# Altium project Half-Bridge Converter.PrjPcb
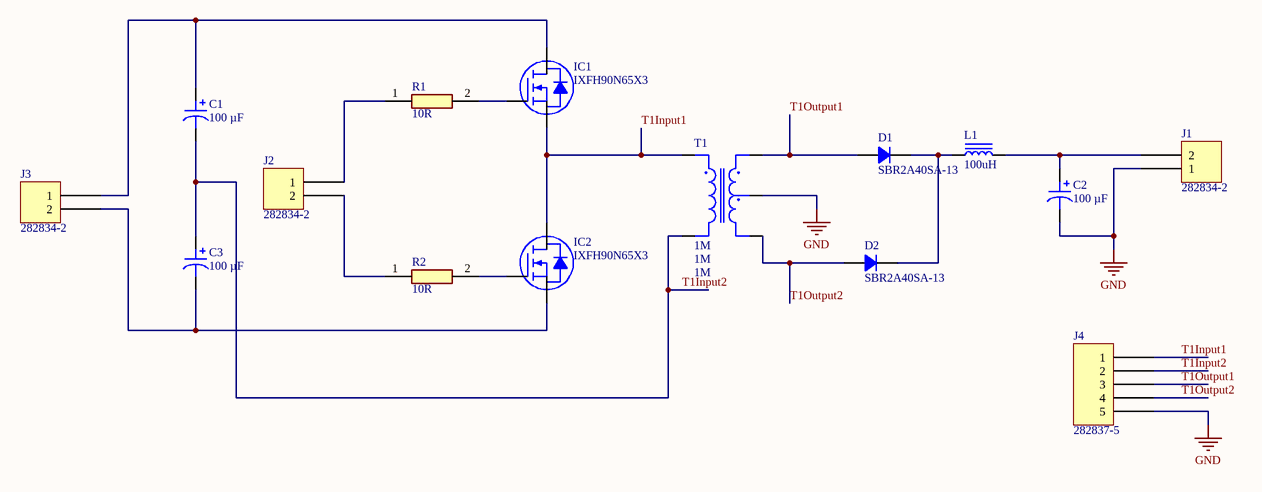
[diagram p0: Sheet1.SchDoc]
1 sheet, 15 parts. Net scope: global (net labels, ports and power ports of the same name join across sheets).
Board file: PCB2.PcbDoc

## Sheet Sheet1.SchDoc
size A4; SheetNumber: 1; SheetTotal: 1

### Parts
C1  100 µF  [CAP AL TH D8 L3.5 H12.5]
C2  100 µF  [CAP AL TH D8 L3.5 H12.5]
C3  100 µF  [CAP AL TH D8 L3.5 H12.5]
D1  SBR2A40SA-13  [DO214AC SMA]
D2  SBR2A40SA-13  [DO214AC SMA]
IC1  IXFH90N65X3  [IXYS TO-247 IXFH FLAT]
IC2  IXFH90N65X3  [IXYS TO-247 IXFH FLAT]
J1  282834-2  [TE 282834-2]
J2  282834-2  [TE 282834-2]
J3  282834-2  [TE 282834-2]
J4  282837-5  [TE 282837-5]
L1  100uH  [BOURNS SRR1280]
R1  10R  [RESAD1680W59L680D250]
R2  10R  [RESAD1680W59L680D250]
T1  L1: 1M  (hidden comment: Ideal Transformer With Central Tap)

### Nets
GND: C2.2 J1.1 J4.5 T1.4
T1Input1: IC1.S IC2.D J4.1 T1.1
T1Input2: C1.2 C3.1 J4.2 T1.2
T1Output1: D1.1 J4.3 T1.3
T1Output2: D2.1 J4.4 T1.5
NetC1_1: C1.1 IC1.D J3.1
NetC2_1: C2.1 J1.2 L1.2
NetC3_2: C3.2 IC2.S J3.2
NetD1_2: D1.2 D2.2 L1.1
NetIC1_G: IC1.G R1.2
NetIC2_G: IC2.G R2.2
NetJ2_1: J2.1 R1.1
NetJ2_2: J2.2 R2.1

### Library data of the parts
C1-C3 = UKL1E101MPD1TD: CAP ALUM 100UF 20% 25V RADIAL; manufacturer: Nichicon; Lifetime @ Temp.: 2000 Hrs @ 85°C; Polarization: Polar; Ripple Current @ High Frequency: 420 mA @ 10 kHz; Ripple Current @ Low Frequency: 280 mA @ 120 Hz; Part Number: UKL1E101MPD1TD; Applications: General Purpose; Capacitance: 100 µF; componentlink1description: Datasheet; componentlink1url: http://nichicon-us.com/english/products/pdfs/e-ukl.pdf; componentlink2description: DigiKey Link; componentlink2url: https://www.digikey.com/en/products/detail/nichicon/UKL1E101MPD1TD/4317977; Device Package: Radial, Can; Height - Seated (Max): 0.492" (12.50mm); lastupdated: 3.06.2024 20:06:12; Lead Spacing: 0.138" (3.50mm); Lifecycle Status: Active; Minimum Order: 1; Mounting Type: Through Hole; Operating Temperature: -40°C ~ 85°C; Package / Case: Radial, Can; packaging: TapeAndBox; partid: 7210; Part Status: Active; price: 0.18; series: UKL; Size / Dimension: 0.315" Dia (8.00mm); Supplier 1: DigiKey; Supplier Part Number 1: 493-10488-1-ND; Tolerance: ±20%; value: 100 µF; Voltage - Rated: 25 V
D1 D2 = SBR2A40SA-13: DIODE SBR 40V 2A SMA; Manufacturer: Diodes Incorporated; Current - Reverse Leakage @ Vr: 500 µA @ 40 V; Diode Type: Super Barrier; Speed: Standard Recovery >500ns, > 200mA (Io); Voltage - Forward (Vf) (Max) @ If: 550 mV @ 2 A; Part Number: SBR2A40SA-13; ComponentLink1Description: Datasheet; ComponentLink1URL: https://www.diodes.com/assets/Datasheets/SBR2A40SA.pdf; ComponentLink2Description: DigiKey Link; ComponentLink2URL: https://www.digikey.com/en/products/detail/diodes-incorporated/SBR2A40SA-13/7725177; Current - Average Rectified (Io): 2A; LastUpdated: 3.06.2024 19:54:28; Lifecycle Status: Active; Minimum Order: 1; Mounting Type: Surface Mount; Operating Temperature - Junction: -65°C ~ 150°C; Package / Case: DO-214AC, SMA; Packaging: TapeAndReel; PartId: 3438; Part Status: Active; Price: 0.13; Series: SBR®; Supplier 1: DigiKey; Supplier Part Number 1: SBR2A40SA-13DICT-ND; Supplier Device Package: SMA; Voltage - DC Reverse (Vr) (Max): 40 V
IC1 IC2 = IXFH90N65X3: MOSFET 90A 650V X3 TO247; Manufacturer: IXYS; Current - Continuous Drain (Id) @ 25°C: 90A (Tc); Drive Voltage (Max Rds On,  Min Rds On): 10V; FET Type: N-Channel; Gate Charge (Qg) (Max) @ Vgs: 95 nC @ 10 V; Input Capacitance (Ciss) (Max) @ Vds: 6080 pF @ 25 V; Power Dissipation (Max): 960W (Tc); Rds On (Max) @ Id, Vgs: 33mOhm @ 45A, 10V; Vgs (Max): ±20V; Vgs(th) (Max) @ Id: 5.2V @ 4mA; Part Number: IXFH90N65X3; ComponentLink2Description: DigiKey Link; ComponentLink2URL: https://www.digikey.com/en/products/detail/ixys/IXFH90N65X3/15776033; Drain to Source Voltage (Vdss): 650 V; LastUpdated: 10.08.2022 04:39:14; Lifecycle Status: Active; Minimum Order: 1; Mounting Type: Through Hole; Operating Temperature: -55°C ~ 150°C (TJ); Packaging: Tube; Part Status: Active; Price: 11.41; Series: HiPerFET™, Ultra X3; Supplier 1: DigiKey; Supplier Part Number 1: 238-IXFH90N65X3-ND; Supplier Device Package: TO-247 (IXFH); Technology: MOSFET (Metal Oxide)
J1-J3 = 282834-2: TERM BLK 2P SIDE ENT 2.54MM PCB; Manufacturer: TE Connectivity AMP Connectors; Current: 10A; Mating Orientation: Horizontal with Board; Number of Levels: 1; Pitch: 0.100" (2.54mm); Positions Per Level: 2; Voltage: 150V; Wire Gauge: 16-30 AWG; Wire Termination: Screw - Rising Cage Clamp; Part Number: 282834-2; Color: Green; ComponentLink1Description: Datasheet; ComponentLink1URL: https://www.te.com/commerce/DocumentDelivery/DDEController?Action=srchrtrv&DocNm=282834&DocType=Customer+Drawing&DocLang=English; ComponentLink2Description: DigiKey Link; ComponentLink2URL: http://digikey.com/product-detail/en/te-connectivity-amp-connectors/282834-2/A98333-ND/1150135; LastUpdated: 15.01.2020 04:15:38; Lifecycle Status: Active; Minimum Order: 1; Mounting Type: Through Hole; Packaging: Bulk; Part Status: Active; Price: 0.88; Series: Buchanan; Supplier 1: DigiKey; Supplier Part Number 1: A98333-ND
J4 = 282837-5: TERM BLK 5P SIDE ENT 5.08MM PCB; Manufacturer: TE Connectivity AMP Connectors; Current: 13.5A; Mating Orientation: Horizontal with Board; Number of Levels: 1; Pitch: 0.200" (5.08mm); Positions Per Level: 5; Voltage: 300V; Wire Gauge: 16-28 AWG; Wire Termination: Screw - Rising Cage Clamp; Part Number: 282837-5; Color: Green; ComponentLink1Description: Datasheet; ComponentLink1URL: https://www.te.com/commerce/DocumentDelivery/DDEController?Action=srchrtrv&DocNm=282837&DocType=Customer+Drawing&DocLang=English; ComponentLink2Description: DigiKey Link; ComponentLink2URL: http://digikey.com/product-detail/en/te-connectivity-amp-connectors/282837-5/282837-5-ND/2259492; Features: Interlocking (Side); LastUpdated: 21.06.2022 15:01:10; Lifecycle Status: Active; Minimum Order: 1; Mounting Type: Through Hole; Packaging: Tray; Part Status: Active; Price: 1.77; Series: Buchanan; Supplier 1: DigiKey; Supplier Part Number 1: 282837-5-ND
L1 = SRR1280-271K: FIXED IND 270UH 1.2A 450MOHM SMD; Manufacturer: Bourns Inc.; Current - Saturation: 1.6A; DC Resistance (DCR): 450mOhm Max; Frequency - Self Resonant: 3.1MHz; Inductance: 270 µH; Inductance Frequency - Test: 100 kHz; Material - Core: Ferrite; Q @ Freq: 20 @ 796kHz; Shielding: Shielded; Tolerance: ±10%; Type: Drum Core, Wirewound; Value: 270 µH; Part Number: SRR1280-271K; ComponentLink1Description: Datasheet; ComponentLink1URL: https://www.bourns.com/docs/Product-Datasheets/SRR1280.pdf; ComponentLink2Description: DigiKey Link; ComponentLink2URL: https://www.digikey.com/en/products/detail/bourns-inc/SRR1280-271K/1970009; Current Rating (Amps): 1.2 A; Device Package: Nonstandard; Height - Seated (Max): 0.315" (8.00mm); LastUpdated: 3.06.2024 20:02:37; Lifecycle Status: Active; Minimum Order: 1; Mounting Type: Surface Mount; Operating Temperature: -40°C ~ 125°C; Package / Case: Nonstandard; Packaging: TapeAndReel; PartId: 13; Part Status: Active; Price: 0.51; Series: SRR1280; Size / Dimension: 0.492" L x 0.492" W (12.50mm x 12.50mm); Supplier 1: DigiKey; Supplier Part Number 1: SRR1280-271KCT-ND
R1 R2 = CFR0W4J0300A50: Resistor; Manufacturer_Name: ROYALOHM; Datasheet Link: https://www.tme.eu/Document/3181dd48312689b59bff6130e2889fcb/CarbonFilm.pdf; Manufacturer_Part_Number: CFR0W4J0300A50
T1 = Transformer With Central Tap Ideal: SimulationGenericComponent: True; L2: 1M; L3: 1M